# EAGLE design synapse-relay-GPIO-USB (EAGLE 5.11)
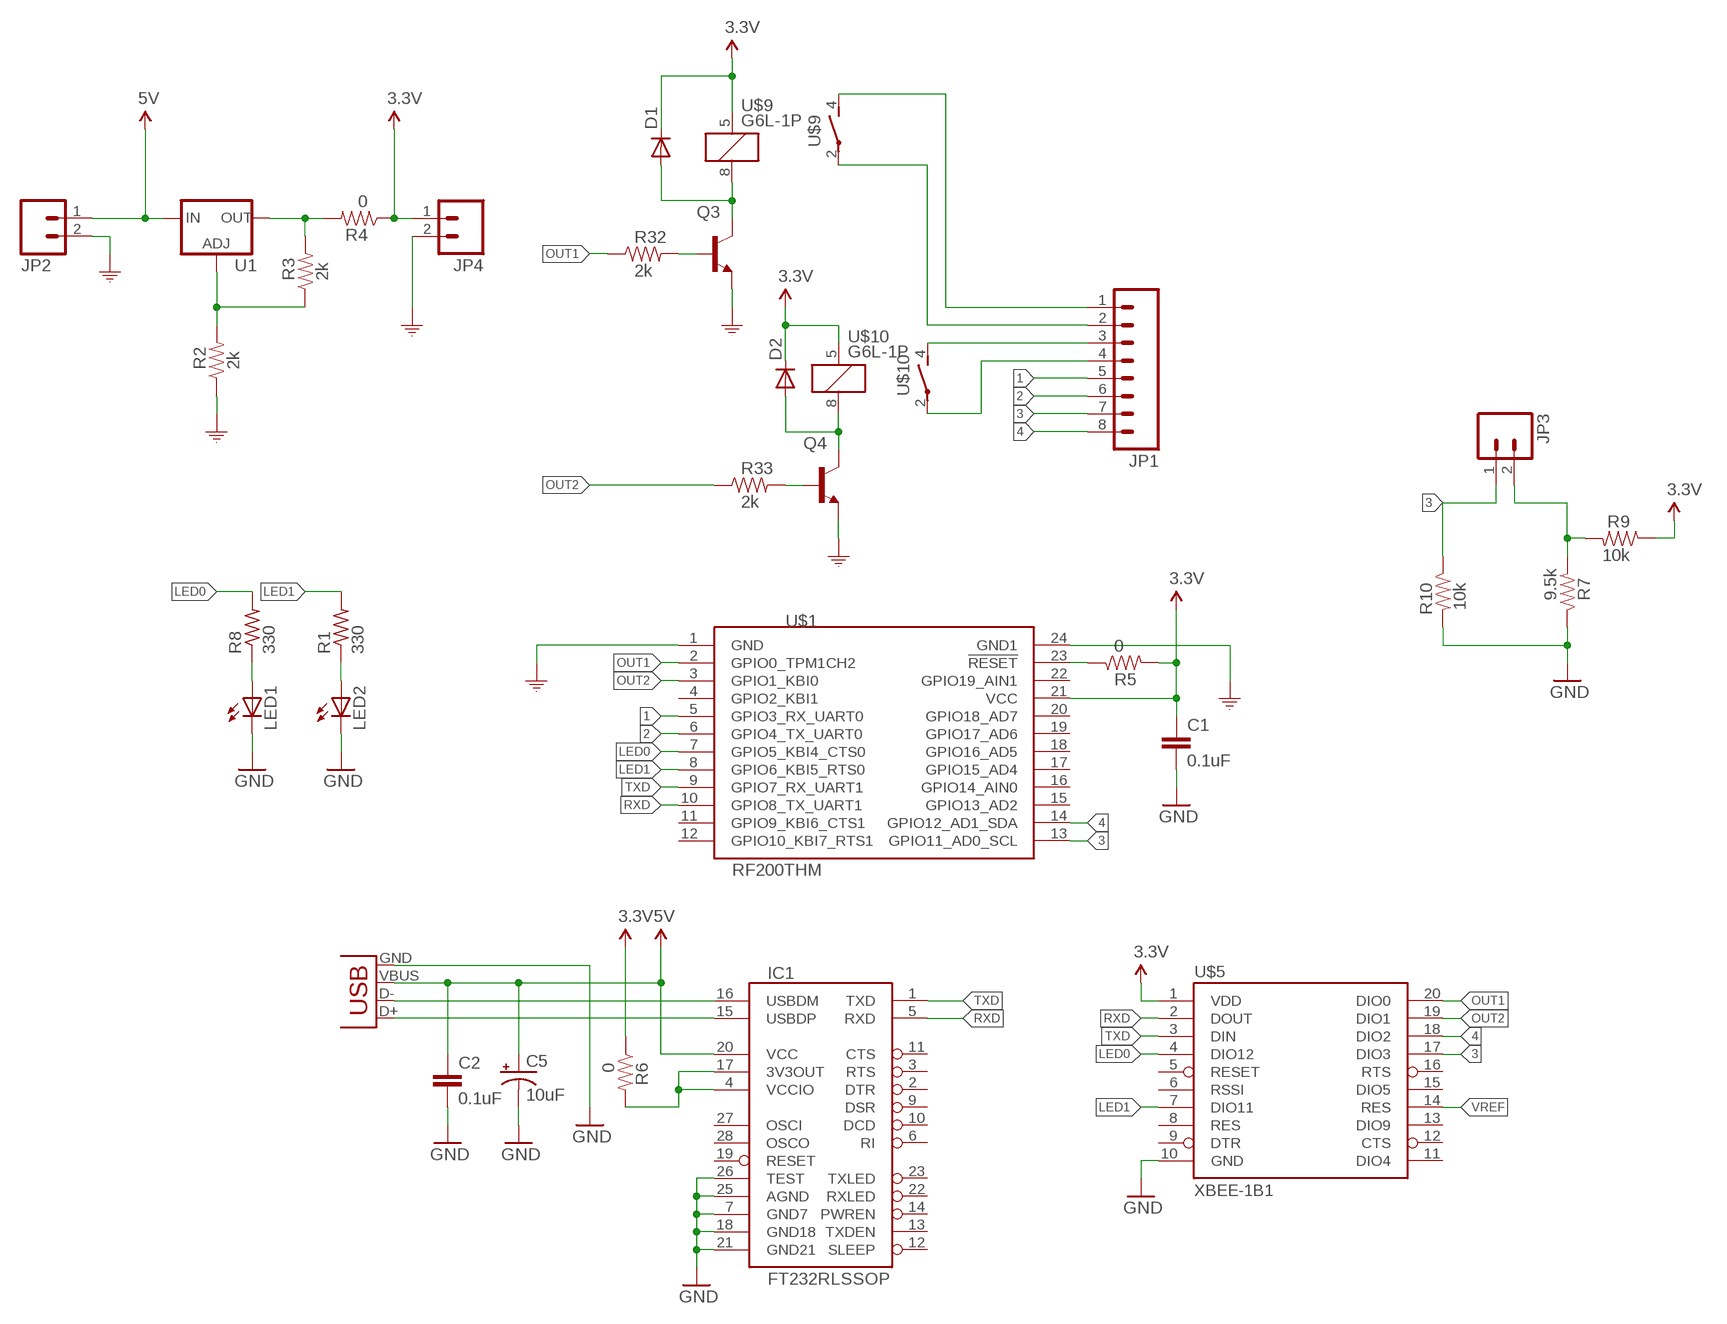
[diagram p0: schematic, sheet 1]

## Parts
C1  0.1uF  CAP0603  [0603]
C2  0.1uF  CAP0603  [0603]
C5  10uF  CAP_POL1206  [EIA3216]
D1  DIODESOD  [SOD-323]
D2  DIODESOD  [SOD-323]
IC1  FT232RLSSOP  [SSOP28DB]
JP1  M083.5MM-8  [SCREWTERMINAL-3.5MM-8]
JP2  M023.5MM  [SCREWTERMINAL-3.5MM-2]
JP3  M023.5MM  [SCREWTERMINAL-3.5MM-2]
JP4  M023.5MM  [SCREWTERMINAL-3.5MM-2]
LED1  LEDCHIP-LED0603  [CHIP-LED0603]
LED2  LEDCHIP-LED0603  [CHIP-LED0603]
Q3  TRANSISTOR_NPNSOT23  [SOT23]
Q4  TRANSISTOR_NPNSOT23  [SOT23]
R1  330  R-US_R0402  [R0402]
R2  2k  RESISTOR0603  [0603]
R3  2k  RESISTOR0603  [0603]
R4  0  RESISTOR0603  [0603]
R5  0  RESISTOR0603  [0603]
R6  0  RESISTOR0603  [0603]
R7  9.5k  RESISTOR0603  [0603]
R8  330  R-US_R0402  [R0402]
R9  10k  RESISTOR0603  [0603]
R10  10k  RESISTOR0603  [0603]
R32  2k  RESISTOR0603  [0603]
R33  2k  RESISTOR0603  [0603]
U1  V_REG_317SMD  [SOT223]
U$1  RF200THM  [SYNAPSERFENGINE-THM]
U$5  XBEE-1B1  [XBEE-1]
U$9  G6L-1P  [G6L-1F]
U$10  G6L-1P  [G6L-1F]
X1  USBSMD  [USB-MINIB]

## Nets
1: JP1.5 U$1.5(GPIO3_RX_UART0)
2: JP1.6 U$1.6(GPIO4_TX_UART0)
3: JP1.7 JP3.1 R10.1 U$1.13(GPIO11_AD0_SCL) U$5.17(DIO3)
3.3V [Power]: C1.1 D1.1(C) D2.1(C) JP4.1 R4.1 R5.2 R6.1 R9.1 U$1.21(VCC) U$5.1(VDD) U$9.5 U$10.5
4: JP1.8 U$1.14(GPIO12_AD1_SDA) U$5.18(DIO2)
5V: C2.1 C5.A(+) IC1.20(VCC) JP2.1 U1.3(IN) X1.VBUS
GND [GND]: C1.2 C2.2 C5.C(-) IC1.7(GND7) IC1.18(GND18) IC1.21(GND21) IC1.25(AGND) IC1.26(TEST) JP2.2 JP4.2 LED1.C LED2.C Q3.2(E) Q4.2(E) R2.1 R7.1 R10.2 U$1.1(GND) U$1.24(GND1) U$5.10(GND) X1.GND ; supply symbol labelled GND1
LED0: R8.2 U$1.7(GPIO5_KBI4_CTS0) U$5.4(DIO12)
LED1: R1.2 U$1.8(GPIO6_KBI5_RTS0) U$5.7(DIO11)
N$1: LED2.A R1.1
N$2: R2.2 R3.1 U1.1(ADJ)
N$3: R3.2 R4.2 U1.2(OUT)
N$4: R5.1 U$1.23(!RESET)
N$5: IC1.16(USBDM) X1.D-
N$6: IC1.15(USBDP) X1.D+
N$7: IC1.4(VCCIO) IC1.17(3V3OUT) R6.2
N$10: LED1.A R8.1
N$16: D1.2(A) Q3.3(C) U$9.8
N$18: Q3.1(B) R32.2
N$21: JP1.1 U$9.4(CONTACT:S)
N$22: JP1.2 U$9.2(CONTACT:P)
N$23: JP1.3 U$10.4(CONTACT:S)
N$24: JP1.4 U$10.2(CONTACT:P)
N$25 [GND]: D2.2(A) Q4.3(C) U$10.8
N$26: Q4.1(B) R33.2
OUT1: R32.1 U$1.2(GPIO0_TPM1CH2) U$5.20(DIO0)
OUT2: R33.1 U$1.3(GPIO1_KBI0) U$5.19(DIO1)
RXD: IC1.5(RXD) U$1.10(GPIO8_TX_UART1) U$5.2(DOUT)
TXD: IC1.1(TXD) U$1.9(GPIO7_RX_UART1) U$5.3(DIN)
VREF: JP3.2 R7.2 R9.2 U$5.14(RES)
Unconnected: IC1.2(DTR) IC1.3(RTS) IC1.6(RI) IC1.9(DSR) IC1.10(DCD) IC1.11(CTS) IC1.12(SLEEP) IC1.13(TXDEN) IC1.14(PWREN) IC1.19(RESET) IC1.22(RXLED) IC1.23(TXLED) IC1.27(OSCI) IC1.28(OSCO) U$1.4(GPIO2_KBI1) U$1.11(GPIO9_KBI6_CTS1) U$1.12(GPIO10_KBI7_RTS1) U$1.15(GPIO13_AD2) U$1.16(GPIO14_AIN0) U$1.17(GPIO15_AD4) U$1.18(GPIO16_AD5) U$1.19(GPIO17_AD6) U$1.20(GPIO18_AD7) U$1.22(GPIO19_AIN1) U$5.5(RESET) U$5.6(RSSI) U$5.8(RES) U$5.9(DTR) U$5.11(DIO4) U$5.12(CTS) U$5.13(DIO9) U$5.15(DIO5) U$5.16(RTS)

## Library data of the parts
C1 C2 = SparkFun:CAP: Capacitor Standard 0603 ceramic capacitor, and 0.1" leaded capacitor.
C5 = SparkFun:CAP_POL: Capacitor Polarized These are standard SMD and PTH capacitors. Normally 10uF, 47uF, and 100uF in electrolytic and tantalum varieties. Always verify the external diameter of the through hole cap, it varies with capacity, voltage, and manufacturer. The EIA devices should be standard.
D1 D2 = SparkFun:DIODE: Diode These are standard reverse protection diodes and small signal diodes. SMA package can handle up to about 1A. SOD-323 can handle about 200mA. What the SOD-323 package when ordering, there are some mfgs out there that are 5-pin packages.
IC1 = SparkFun:FT232RL: USB UART FT232RL 4th Generation USB UART (USB <-> Serial) Controller. Spark Fun Electronics SKU : COM-00650
JP1 = SparkFun:M08: Header 8 Standard 8-pin 0.1" header. Use with straight break away headers (SKU : PRT-00116), right angle break away headers (PRT-00553), swiss pins (PRT-00743), machine pins (PRT-00117), and female headers (PRT-00115).
JP2-JP4 = SparkFun:M02: Header 2 Standard 2-pin 0.1" header. Use with straight break away headers (SKU : PRT-00116), right angle break away headers (PRT-00553), swiss pins (PRT-00743), machine pins (PRT-00117), and female headers (PRT-00115). Molex polarized connector foot print use with SKU : PRT-08233 with associated crimp pins and housings.
LED1 LED2 = adafruit:LED: LED OSRAM: - CHIPLED LG R971, LG N971, LY N971, LG Q971, LY Q971, LO R971, LY R971 LH N974, LH R974 LS Q976, LO Q976, LY Q976 LO Q996 - Hyper CHIPLED LW Q18S LB Q993, LB Q99A, LB R99A - SideLED LS A670, LO A670, LY A670, LG A670, LP A670 LB A673, LV A673, LT A673, LW A673 LH A674 LY A675 LS A676, LA A676, LO A676, LY A676, LW A676 LS A679, LY A679, LG A679 - Hyper Micro SIDELED® LS Y876, LA Y876, LO Y876, LY Y876 LT Y87S - SmartLED LW L88C, LW L88S LB L89C, LB L89S, LG L890 LS L89K, LO L89K, LY L89K LS L896, LA L896, LO L896, LY L896 - TOPLED LS T670, LO T670, LY T670, LG T670, LP T670 LSG T670, LSP T670, LSY T670, LOP T670, LYG T670 LG T671, LOG T671, LSG T671 LB T673, LV T673, LT T673, LW T673 LH T674 LS T676, LA T676, LO T676, LY T676, LB T676, LH T676, LSB T676, LW T676 LB T67C, LV T67C, LT T67C, LS T67K, LO T67K, LY T67K, LW E67C LS E67B, LA E67B, LO E67B, LY E67B, LB E67C, LV E67C, LT E67C LW T67C LS T679, LY T679, LG T679 LS T770, LO T770, LY T770, LG T770, LP T770 LB T773, LV T773, LT T773, LW T773 LH T774 LS E675, LA E675, LY E675, LS T675 LS T776, LA T776, LO T776, LY T776, LB T776 LHGB T686 LT T68C, LB T68C - Hyper Mini TOPLED® LB M676 - Mini TOPLED Santana® LG M470 LS M47K, LO M47K, LY M47K Source: http://www.osram.convergy.de/
Q3 Q4 = SparkFunEagle-6-6-07:TRANSISTOR_NPN: Transistor NPN BJT configuration in SOT23 package. MMBT2222 is the common NPN we use. Double check BCE configuration again layout.
R1 R8 = adafruit:R-US_: RESISTOR, American symbol
R2-R7 R9 R10 R32 R33 = SparkFunEagle-6-6-07:RESISTOR: Resistor Basic schematic elements and footprints for 0603, 1206, and PTH 1/10th watt (small) resistors.
U1 = SparkFun:V_REG_317: Voltage Regulator Standard LM317 adjustable voltage regulator. AOI (Adjust Output Input). Google 'LM317 Calculator' for easy to use app to get the two resistor values needed. 240/720 for 5V output. 240/390 for 3.3V output. Spark Fun Electronics SKU : COM-00527
U$1 = Synapse-RFEngine:RF200
U$5 = SparkFun:XBEE-1
U$9 U$10 = michael:G6L-1P: SMT relay
X1 = SparkFun:USB: USB Connectors USB-B-PTH is fully proven SKU : PRT-00139 USB-miniB is fully proven SKU : PRT-00587 USB-A-PCB is untested. USB-A-H is throughly reviewed, but untested. Spark Fun Electronics SKU : PRT-00437 USB-B-SMT is throughly reviewed, but untested. Needs silkscreen touching up. USB-A-S has not been used/tested USB-MB-H has not been used/tested

## Net classes
0 default: width 0.203 mm, drill 0.203 mm, clearance 0.203 mm
1 Power: width 0.406 mm, drill 0.203 mm, clearance 0.203 mm
2 GND: width 0.406 mm, drill 0.203 mm, clearance 0.203 mm

## Board
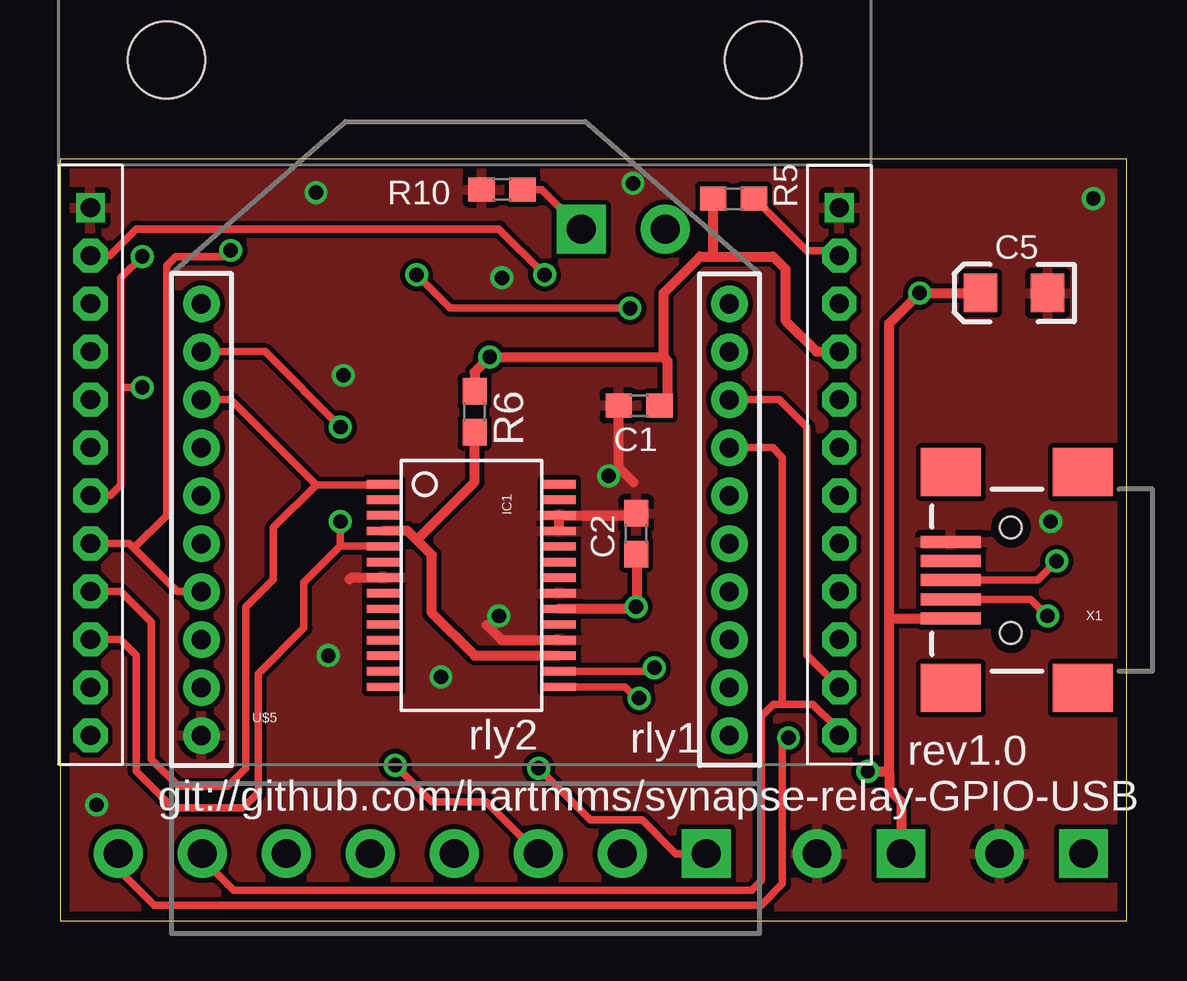
[diagram p1: board, top side]
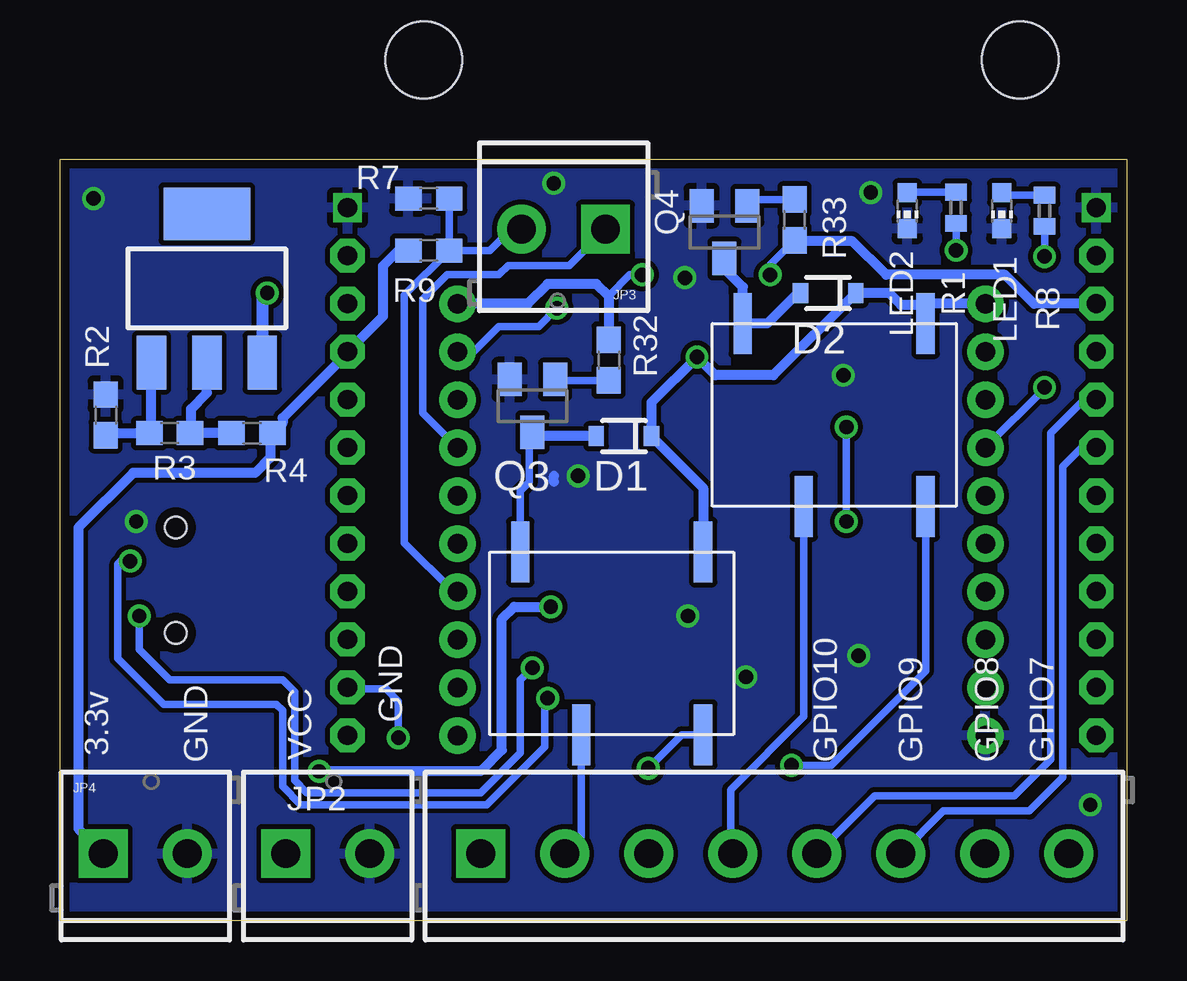
[diagram p2: board, bottom side, seen from below]

Size 44.45 x 31.75 mm. Coordinates in mm from the lower left corner, seen from the top.
Outline: 0,0 44.45,0 44.45,31.75 0,31.75 0,0
Copper layers (1*16): Top 0.0356mm / dielectric 1.5011mm / Bottom 0.0356mm
Design rules "LaenPCBOrder": minimum track width 6mil, minimum drill 13mil, track to track 6mil, track to pad 6mil, pad to pad 6mil, via to via 6mil, smd to smd 6mil, copper to edge 15mil, drill to drill 6mil, minimum pad ring 7mil, minimum via ring 7mil, stop-mask expansion 4mil, vias tented up to drill 0mil, thermal gap 10mil

### Footprints (pad centres in the part's own frame; a part is rotated, then mirrored left to right if it is on the bottom)
0603 = smd 1.1 x 1: 1 -0.85,0; 2 0.85,0
EIA3216 = smd 1.4 x 1.6: A 1.4,0; C -1.4,0
SOD-323 = smd 0.63 x 0.83: 1 -1.15,0; 2 1.15,0
SSOP28DB = smd 0.348 x 1.397: 1 -4.225,-3.656; 2 -3.575,-3.656; 3 -2.925,-3.656; 4 -2.275,-3.656; 5 -1.625,-3.656; 6 -0.975,-3.656; 7 -0.325,-3.656; 8 0.325,-3.656; 9 0.975,-3.656; 10 1.625,-3.656; 11 2.275,-3.656; 12 2.925,-3.656; 13 3.575,-3.656; 14 4.225,-3.656; 15 4.225,3.656; 16 3.575,3.656; 17 2.925,3.656; 18 2.275,3.656; 19 1.625,3.656; 20 0.975,3.656; 21 0.325,3.656; 22 -0.325,3.656; 23 -0.975,3.656; 24 -1.625,3.656; 25 -2.275,3.656; 26 -2.925,3.656; 27 -3.575,3.656; 28 -4.225,3.656
SCREWTERMINAL-3.5MM-8 = drill 1.2 pad 2.032 square: 1 0,0 | drill 1.2 pad 2.032 round: 2 3.5,0; 3 7,0; 4 10.5,0; 5 14,0; 6 17.5,0; 7 21,0; 8 24.5,0
SCREWTERMINAL-3.5MM-2 = drill 1.2 pad 2.032 square: 1 0,0 | drill 1.2 pad 2.032 round: 2 3.5,0
CHIP-LED0603 = smd 0.8 x 0.8: A 0,-0.75; C 0,0.75
SOT23 = smd 1 x 1.4: 1 -0.95,-1.1; 2 0.95,-1.1; 3 0,1.1
R0402 = smd 0.7 x 0.9: 1 -0.65,0; 2 0.65,0
SOT223 = smd 1.219 x 2.235: 1 -2.311,-3.099; 2 0,-3.099; 3 2.311,-3.099 | smd 3.6 x 2.2: 4 0,3.099
SYNAPSERFENGINE-THM = drill 0.8 square: 1 0,0; 24 31.2,0 | drill 0.8 pad 1.422 octagon: 2 0,-2; 3 0,-4; 4 0,-6; 5 0,-8; 6 0,-10; 7 0,-12; 8 0,-14; 9 0,-16; 10 0,-18; 11 0,-20; 12 0,-22; 13 31.2,-22; 14 31.2,-20; 15 31.2,-18; 16 31.2,-16; 17 31.2,-14; 18 31.2,-12; 19 31.2,-10; 20 31.2,-8; 21 31.2,-6; 22 31.2,-4; 23 31.2,-2 | hole 3.2: 3.17,6.16; 28.03,6.16
XBEE-1 = drill 0.8 pad 1.524 round: 1 -11,20; 2 -11,18; 3 -11,16; 4 -11,14; 5 -11,12; 6 -11,10; 7 -11,8; 8 -11,6; 9 -11,4; 10 -11,2; 11 11,2; 12 11,4; 13 11,6; 14 11,8; 15 11,10; 16 11,12; 17 11,14; 18 11,16; 19 11,18; 20 11,20
G6L-1F = smd 0.762 x 2.54: 2 -2.54,-3.81; 4 2.54,-3.81; 5 2.54,3.81; 8 -5.08,3.81
USB-MINIB = smd 2.5 x 0.5: D+ 2.5,0; D- 2.5,0.8; GND 2.5,-1.6; ID 2.5,-0.8; VBUS 2.5,1.6 | smd 2.5 x 2: MTN1 -3,4.5; MTN2 2.5,4.5; MTN3 -3,-4.5; MTN4 2.5,-4.5 | hole 0.9: 0,2.2; 0,-2.2

### Placement (x,y rotation side)
C1  24.13,21.46 180 top
C2  24,16.13 90 top
C5  39.75,26.16 180 top
D1  20.95,20.19 180 bottom
D2  12.45,26.16 180 bottom
IC1  17.14,13.97 270 top
JP1  26.92,2.79 0 bottom
JP2  35.04,2.79 0 bottom
JP3  21.72,28.83 180 bottom
JP4  42.65,2.79 0 bottom
LED1  5.21,29.59 180 bottom
LED2  9.14,29.59 180 bottom
Q3  24.77,21.46 180 bottom
Q4  16.76,28.7 180 bottom
R1  7.11,29.72 270 bottom
R2  42.55,21.08 270 bottom
R3  39.88,20.32 0 bottom
R4  36.45,20.32 180 bottom
R5  28.07,30.1 180 top
R6  17.27,21.21 270 top
R7  29.08,30.1 0 bottom
R8  3.43,29.59 270 bottom
R9  29.08,27.94 0 bottom
R10  18.41,30.48 180 top
R32  21.59,23.37 270 bottom
R33  13.84,29.21 90 bottom
U1  38.33,26.36 0 bottom
U$1  1.27,29.72 0 top
U$5  16.89,5.71 0 top
U$9  20.19,11.56 0 bottom
U$10  10.92,21.08 0 bottom
X1  39.62,14.19 180 top

### Tracks (layer width: path | path; a pad name or v marks a point on that pad's centre or on a via)
1
  Bottom 0.305: U$1.5 1.78,21.72 3.17,20.32 3.17,6.73 4.7,5.21 10.51,5.21 JP1.5
2
  Bottom 0.305: U$1.6 1.87,19.72 2.67,18.92 2.67,5.97 4.06,4.57 7.65,4.57 JP1.6
3
  Top 0.305: JP1.7 5.92,2.58 7.24,1.27 28.83,1.27 29.21,1.65 29.21,8.51 29.72,9.02 30.1,9.02 | U$1.13 32.31,7.87 32.31,8.07 31.37,9.02 30.1,9.02 | U$5.17 29.69,19.71 30.1,19.3 30.1,9.02 | R10.1 20.07,30.48 JP3.1
  Bottom 0.305: U$5.17 29.34,21.16 29.34,25.91 28.32,26.92 26.16,26.92 25.78,27.3 23.24,27.3 JP3.1
3.3V  (via drill 0.6)
  Top 0.406: U$1.21 31.53,23.72 30.23,25.02 30.23,27.18 29.72,27.69 27.3,27.69 | 25.15,21.63 C1.1 25.31,21.8 25.31,23.33 25.15,23.5 | R6.1 17.27,22.86 v17.91,23.5 25.15,23.5 | 27.3,27.69 26.67,27.69 25.15,26.16 25.15,23.5 | R5.2 27.22,27.77 27.3,27.69
  Bottom 0.406: JP4.1 43.69,3.84 43.69,16.38 41.4,18.67 36.32,18.67 35.69,19.3 35.69,20.23 | U$5.1 8.32,25.71 8.38,25.65 | 8.38,25.65 U$10.5 | 8.38,25.65 9.4,25.65 9.91,26.16 D2.1 14.72,22.73 17.14,22.73 v17.91,23.5 19.8,21.6 D1.1 17.65,18.04 U$9.5 | R9.1 30.35,27.94 30.99,27.3 30.99,25.2 U$1.21 32.47,23.66 35.18,20.95 35.18,20.74 R4.1
  Bottom 0.508: R4.1 35.69,20.23
4  (via drill 0.6)
  Top 0.305: U$5.18 29.97,21.71 31.11,20.57 31.11,11.07 U$1.14 | JP1.8 2.42,2.15 3.94,0.64 29.21,0.64 30.1,1.52 30.1,7.37 v30.35,7.62
  Bottom 0.305: v30.35,7.62 30.35,9.14 30.86,9.65 32.4,9.65 U$1.14
5V  (via drill 0.6)
  Top 0.406: JP2.1 35.04,4.96 34.54,5.46 34.54,6.22 | 34.54,6.22 34.54,12.57 | 34.54,12.57 34.54,24.89 v35.81,26.16 C5.A | X1.VBUS 34.56,12.59 34.54,12.57 | v33.66,6.22 34.54,6.22 | C2.1 24.04,15.24 24.04,13.12 v24,13.08 23.92,12.99 IC1.20
  Bottom 0.406: v33.66,6.22 26.92,6.22 26.04,7.11 26.04,12.57 25.53,13.08 v24,13.08
  Bottom 0.508: U1.3 36.02,25.96 v35.81,26.16
GND  (via drill 0.6)
  Top 0.406: IC1.7 12.14,14.29 12.06,14.22 | C2.2 23.89,16.89 | 24,16.89 IC1.26 IC1.25 | 24,16.89 | 24,16.89 23.88,17.02 | C1.2 23.28,18.88 23.89,18.28 | IC1.18 18.4,11.7 17.78,12.32
  Bottom 0.406: 23.88,18.29 23.88,18.54
  other vias: 11.81,22.73 18.41,26.8 22.86,18.54 18.29,12.7 11.18,11.05 41.27,16.64 23.88,30.73 1.52,4.83 10.67,30.35 15.88,10.16 43.05,30.1
  pour Bottom: 0,0.1 0.25,31.5 44.2,31.5 44.2,0.1
  pour Top: 0,0 0,31.62 44.45,31.62 44.45,0.13 44.45,0
LED0  (via drill 0.6)
  Top 0.305: U$1.7 2.1,17.72 2.54,18.16 2.54,22.23 | 2.54,22.23 2.54,26.8 v3.43,27.69 | 2.54,22.23 v3.43,22.23
  Bottom 0.305: v3.43,27.69 R8.2 | v3.43,22.23 3.43,22.18 U$5.4
LED1  (via drill 0.6)
  Top 0.305: U$1.8 2.89,15.72 3.08,15.53 | v7.11,27.94 6.86,27.69 4.83,27.69 4.45,27.3 4.45,16.89 3.08,15.53 | U$5.7 4.89,13.71 3.08,15.53
  Bottom 0.305: v7.11,27.94 R1.2
N$1
  Bottom 0.305: R1.1 9.12,30.37 LED2.A
N$2
  Bottom 0.406: U1.1 40.64,20.34 R3.1 42.46,20.32 R2.2 42.84,20.27
N$3
  Bottom 0.406: R4.2 R3.2 38.99,20.36 38.99,21.34 38.33,22 U1.2
N$4
  Top 0.305: R5.1 28.96,30.1 31.11,27.94 32.25,27.94 U$1.23
N$5  (via drill 0.6)
  Top 0.305: X1.D- 40.46,13.39 v41.15,12.7 | IC1.16 24.62,10.39 v24.77,10.54
  Bottom 0.305: v41.15,12.7 41.15,11.3 39.88,10.03 35.18,10.03 34.67,9.53 34.67,5.84 34.16,5.33 26.92,5.33 25.27,6.99 25.27,10.03 v24.77,10.54
N$6  (via drill 0.6)
  Top 0.305: X1.D+ 40.73,14.19 v41.53,14.99 | v24.13,9.27 24,9.27 23.53,9.74 IC1.15
  Bottom 0.305: v41.53,14.99 41.91,14.99 42.04,14.86 42.04,10.92 40.13,9.02 35.43,9.02 35.18,8.76 35.18,5.59 34.42,4.83 26.67,4.83 24.26,7.24 24.26,9.14 v24.13,9.27
N$7
  Top 0.305: IC1.17
  Top 0.406: IC1.4 14.49,16.25 14.86,15.88 | 14.86,15.88 15.49,15.24 15.49,12.83 17.27,11.05 IC1.17 | 14.86,15.88 17.27,18.29 R6.2
N$10
  Bottom 0.305: R8.1 5.11,30.24 LED1.A
N$16
  Bottom 0.305: U$9.8 25.27,17.91 24.89,18.29 24.89,20.24 Q3.3
  Bottom 0.406: D1.2 24.59,20.19 Q3.3
N$18
  Bottom 0.305: R32.2 23.77,22.52 Q3.1
N$21  (via drill 0.6)
  Top 0.305: JP1.1 25.65,2.79 24.26,4.19 22.1,4.19 v19.94,6.35
  Bottom 0.305: U$9.4 18.54,7.75 v19.94,6.35
N$22
  Bottom 0.305: U$9.2 22.73,3.48 JP1.2
N$23  (via drill 0.6)
  Top 0.305: JP1.3 17.77,4.95 15.49,4.95 v13.97,6.48
  Bottom 0.305: U$10.4 8.38,10.41 12.32,6.48 v13.97,6.48
N$24
  Bottom 0.305: U$10.2 13.46,8.51 16.51,5.46 16.51,2.88 JP1.4
N$25
  Bottom 0.406: Q4.3 16.76,27.18 16,26.42 U$10.8 14.99,24.89 13.72,26.16 D2.2
N$26
  Bottom 0.305: 15.73,29.72 Q4.1 15.56,30.06 R33.2
OUT1  (via drill 0.6)
  Top 0.305: U$1.2 2.06,27.72 3.05,28.7 3.17,28.83 18.29,28.83 v20.19,26.92
  Bottom 0.305: v20.19,26.92 20.7,26.92 21.59,26.04
  Bottom 0.406: U$5.20 24.96,25.71 24.13,26.54 22.1,26.54 21.59,26.04 R32.1
OUT2  (via drill 0.6)
  Top 0.305: v23.75,25.53 16.26,25.53 v14.86,26.92
  Bottom 0.305: U$5.19 27.21,23.71 26.16,24.77 24.51,24.77 v23.75,25.53 | v14.86,26.92 14.86,27.34 R33.1
  Bottom 0.406: U$1.3 3.87,25.72 5.08,26.92 10.03,26.92 11.43,28.32 13.8,28.32 R33.1
RXD  (via drill 0.6)
  Top 0.305: 11.68,15.62 10.16,14.1 10.16,12.19 8.26,10.29 8.26,5.33 7.62,4.7 4.7,4.7 3.17,6.22 3.17,11.05 2.51,11.72 U$1.10 | 11.68,15.62 13.46,15.62 IC1.5 | U$5.2 8.54,23.71 v11.68,20.57 | 11.68,15.62 v11.68,16.64
  Bottom 0.305: v11.68,16.64 v11.68,20.57
TXD
  Top 0.305: 10.67,18.16 8.89,16.38 8.89,14.22 7.75,13.08 7.75,6.35 6.99,5.59 4.95,5.59 3.81,6.73 3.81,12.45 2.54,13.72 U$1.9 | 10.67,18.16 13.46,18.16 IC1.1 | U$5.3 7.11,21.71 10.67,18.16
VREF
  Bottom 0.305: R9.2 26.54,27.94 25.65,28.83 JP3.2 | R9.2 28.23,27.65 | R9.2 R7.2 | U$5.14 28.07,13.71 30.1,15.75 30.1,26.07 R9.2

### Text on the board
tNames: rly2 | rly1 | rev1.0 | git://github.com/hartmms/synapse-relay-GPIO-USB
bNames: GND | VCC | GND | 3.3v | GPIO7 | GPIO8 | GPIO9 | GPIO10